# Altium schematic sheet YA-N-Radio.SchDoc: Yet Another IoT Node - Radio
size A4; Revision: 1.0; SheetNumber: 4; SheetTotal: 5
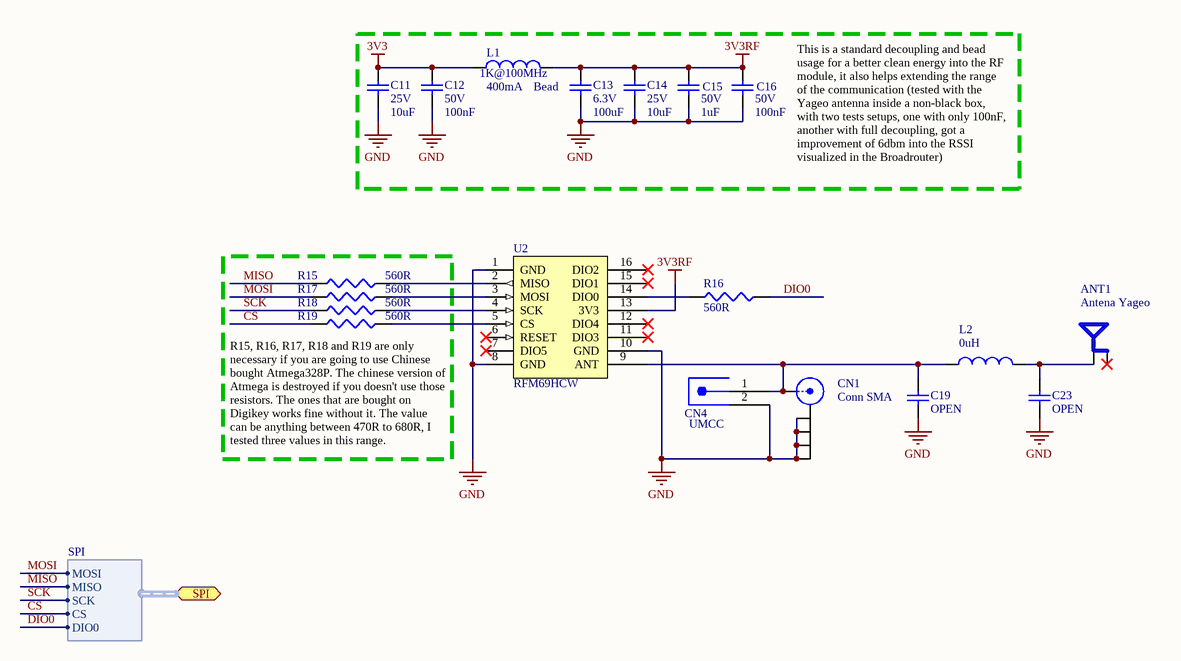
[diagram p0: YA-N-Radio.SchDoc]

## Parts
ANT1  value Antena Yageo  [ANT1204LL05R0915A]  (hidden comment: Antena)
C11  value 10uF  Tensão: 25V  [CC0805]  (hidden comment: Capacitor Cerâmico)
C12  value 100nF  Tensão: 50V  [CC0603]  (hidden comment: Capacitor Cerâmico)
C13  value 100uF  Tensão: 6.3V  [CC1206]  (hidden comment: Capacitor Cerâmico)
C14  value 10uF  Tensão: 25V  [CC0805]  (hidden comment: Capacitor Cerâmico)
C15  value 1uF  Tensão: 50V  [CC0603]  (hidden comment: Capacitor Cerâmico)
C16  value 100nF  Tensão: 50V  [CC0603]  (hidden comment: Capacitor Cerâmico)
C19  value OPEN  [CC0603]  (hidden comment: Capacitor Cerâmico)  (no BOM)
C23  value OPEN  [CC0603]  (hidden comment: Capacitor Cerâmico)  (no BOM)
CN1  Conn SMA  [CONN SMA-JACK]
CN4  UMCC  [CONN U.FL]
L1  Bead  value 1K@100MHz  Corrente: 400mA  [CC0603]
L2  value 0uH  [CC0603]  (hidden comment: Bead)
R15  value 560R  [CC0603]  (hidden comment: Resistor)
R16  value 560R  [CC0603]  (hidden comment: Resistor)
R17  value 560R  [CC0603]  (hidden comment: Resistor)
R18  value 560R  [CC0603]  (hidden comment: Resistor)
R19  value 560R  [CC0603]  (hidden comment: Resistor)
U2  RFM69HCW  [RFM69HCW]

## Ports
SPI (harness SPI)

## Harnesses
SPI: MOSI, MISO, SCK, CS, DIO0

## Nets
3V3: C11.2 C12.2 L1.1
3V3RF: C13.2 C14.2 C15.2 C16.2 L1.2 U2.13(3V3)
GND: C11.1 C12.1 C13.1 C14.1 C15.1 C16.1 C19.1 C23.1 CN1.2(Y) CN1.3(Y) CN1.4(Y) CN1.5(Y) CN4.2 U2.1(GND) U2.8(GND) U2.10(GND)
CS: R19.1 ; port SPI.CS
DIO0: R16.2 ; port SPI.DIO0
MISO: R15.1 ; port SPI.MISO
MOSI: R17.1 ; port SPI.MOSI
SCK: R18.1 ; port SPI.SCK
NetANT1_1: ANT1.1 C23.2 L2.2
NetC19_2: C19.2 CN1.1(X) CN4.1 L2.1 U2.9(ANT)
NetR15_2: R15.2 U2.2(MISO)
NetR16_1: R16.1 U2.14(DIO0)
NetR17_2: R17.2 U2.3(MOSI)
NetR18_2: R18.2 U2.4(SCK)
NetR19_2: R19.2 U2.5(CS)

Not connected (* = marked no-connect by the designer): ANT1 2*; U2 6(RESET)* 7(DIO5)* 11(DIO3)* 12(DIO4)* 15(DIO1)* 16(DIO2)*

## Notes on the sheet
- This is a standard decoupling and bead usage for a better clean energy into the RF module, it also helps extending the range of the communication (tested with the Yageo antenna inside a non-black box, with two tests setups, one with only 100nF, another with full decoupling, got a improvement of 6dbm into the RSSI visualized in the Broadrouter)
- (near R19) R15, R16, R17, R18 and R19 are only necessary if you are going to use Chinese bought Atmega328P. The chinese version of Atmega is destroyed if you doesn't use those resistors. The ones that are bought on Digikey works fine without it. The value can be anything between 470R to 680R, I tested three values in this range.
- Projeto:
- Tamanho:
- Data:
- A4
- Eng. Felipe Navarro
- Hora:
- Revisão:
- Folha
- de
- Arquivo:

## Library data of the parts
ANT1 = Antena Yageo 915Mhz: Antena YAGEO; Chinês: ----; ChinesePrice: 0,00000; Corrente: *; Potência: *; Supplier 1: Digi-Key; Supplier Part Number 1: 311-1525-1-ND; Tensão: *; Obs:: *; Tolerância: *; ComponentLink1Description: Datasheet; ComponentLink1URL: D:\Tecnoclade\Datasheet\
C11 C14 = Cap 10uF 25V 0805 X5R: Capacitor (Semiconductor SIM Model); Chinês: Local; ChinesePrice: 0,02620; Corrente: *A; Potência: *W; Obs:: X5R; Tolerância: ±10%; Supplier 1: Digi-Key; Supplier Part Number 1: 587-2985-1-ND; ComponentLink1Description: Datasheet; ComponentLink1URL: D:\Tecnoclade\Datasheet\!DataMissing.pdf
C12 C16 = Cap 100nF 50V 0603 X7R: Capacitor (Semiconductor SIM Model); Chinês: Local; ChinesePrice: 0,00250; Corrente: *A; Potência: *W; Obs:: X7R; Tolerância: ±10%; Supplier 1: Digi-Key; Supplier Part Number 1: 1276-1000-1-ND; ComponentLink1Description: Datasheet; ComponentLink1URL: D:\Tecnoclade\Datasheet\!DataMissing.pdf
C13 = Cap 100uF 6.3V 1206 X5R: Capacitor (Semiconductor SIM Model); Chinês: -----; ChinesePrice: 0,00000; Corrente: *A; Potência: *W; Obs:: X5R; Tolerância: ±20%; Supplier 1: Digi-Key; Supplier Part Number 1: 490-7217-1-ND; ComponentLink1Description: Datasheet; ComponentLink1URL: D:\Tecnoclade\Datasheet\!DataMissing.pdf
C15 = Cap 1uF 50V 0603 X5R: Capacitor (Semiconductor SIM Model); Chinês: Local; ChinesePrice: 0,01100; Corrente: *A; Potência: *W; Obs:: X5R; Tolerância: ±10%; Supplier 1: Digi-Key; Supplier Part Number 1: 587-2400-1-ND; ComponentLink1Description: Datasheet; ComponentLink1URL: D:\Tecnoclade\Datasheet\!DataMissing.pdf
C19 C23 = Cap OPEN 0603: Capacitor (Semiconductor SIM Model); Chinês: -----; ChinesePrice: 0,00000; Corrente: *A; Potência: *W; Tolerância: ±*%; Tensão: *V; Supplier 1: Digi-Key; Supplier Part Number 1: --Del; Obs:: *; ComponentLink1Description: Datasheet; ComponentLink1URL: D:\Tecnoclade\Datasheet\!DataMissing.pdf
CN1 = Conn SMA: Conector SMA; ChinesePrice: 0,00000; Chinês: ----; Corrente: *; Potência: *; Supplier 1: Digi-Key; Supplier Part Number 1: A97593-ND; Tensão: *; Value: SMA; Obs:: *; Tolerância: *; ComponentLink1Description: Datasheet; ComponentLink1URL: D:\Tecnoclade\Datasheet\!DataMissing.pdf
CN4 = Conn UMCC TE: ChinesePrice: 0,00000; Chinês: ----; Value: *; Corrente: *; Potência: *; Supplier 1: Digi-Key; Supplier Part Number 1: A118077CT-ND; Tensão: *; Obs:: *; Tolerância: *; ComponentLink1Description: Datasheet; ComponentLink1URL: D:\Tecnoclade\Datasheet\!DataMissing.pdf
L1 = Bd 1K@100MHz 0603 400mA: ChinesePrice: 0,00000; Chinês: -----; Obs:: Ferrite (0R5); Tolerância: ±25%; Potência: *; Supplier 1: Digi-Key; Supplier Part Number 1: 445-1550-1-ND; Tensão: *; ComponentLink1Description: Datasheet; ComponentLink1URL: D:\Tecnoclade\Datasheet\!DataMissing.pdf; Substituição: 27/06/2014
L2 = Bd 1K@100MHz 0603 400mA: ChinesePrice: 0,00000; Chinês: -----; Obs:: Ferrite (0R5); Tolerância: ±25%; Corrente: 400mA; Potência: *; Supplier 1: Digi-Key; Supplier Part Number 1: 712-1432-1-ND; Tensão: *; ComponentLink1Description: Datasheet; ComponentLink1URL: D:\Tecnoclade\Datasheet\!DataMissing.pdf; Substituição: 27/06/2014
R15-R19 = Res 560R 1% 0603 1/10w: ChinesePrice: 0,00000; Chinês: ----; Corrente: *A; Potência: 1/10W; Tensão: *V; Tolerância: ±*%; Supplier 1: Digi-Key; Supplier Part Number 1: 311-560HRCT-ND; Obs:: *; ComponentLink1Description: Datasheet; ComponentLink1URL: D:\Tecnoclade\Datasheet\!DataMissing.pdf
U2 = RFM69HCW: Memória; ChinesePrice: 4,34; Chinês: Local; Value: Rádio 915Mhz; Corrente: *; Potência: *; Supplier 1: Digi-Key; Supplier Part Number 1: --Del; Tensão: *; Obs:: *; Tolerância: *; ComponentLink1Description: Datasheet; ComponentLink1URL: D:\Tecnoclade\Datasheet\!DataMissing.pdf